# EAGLE design tsalivd (EAGLE 5.11)
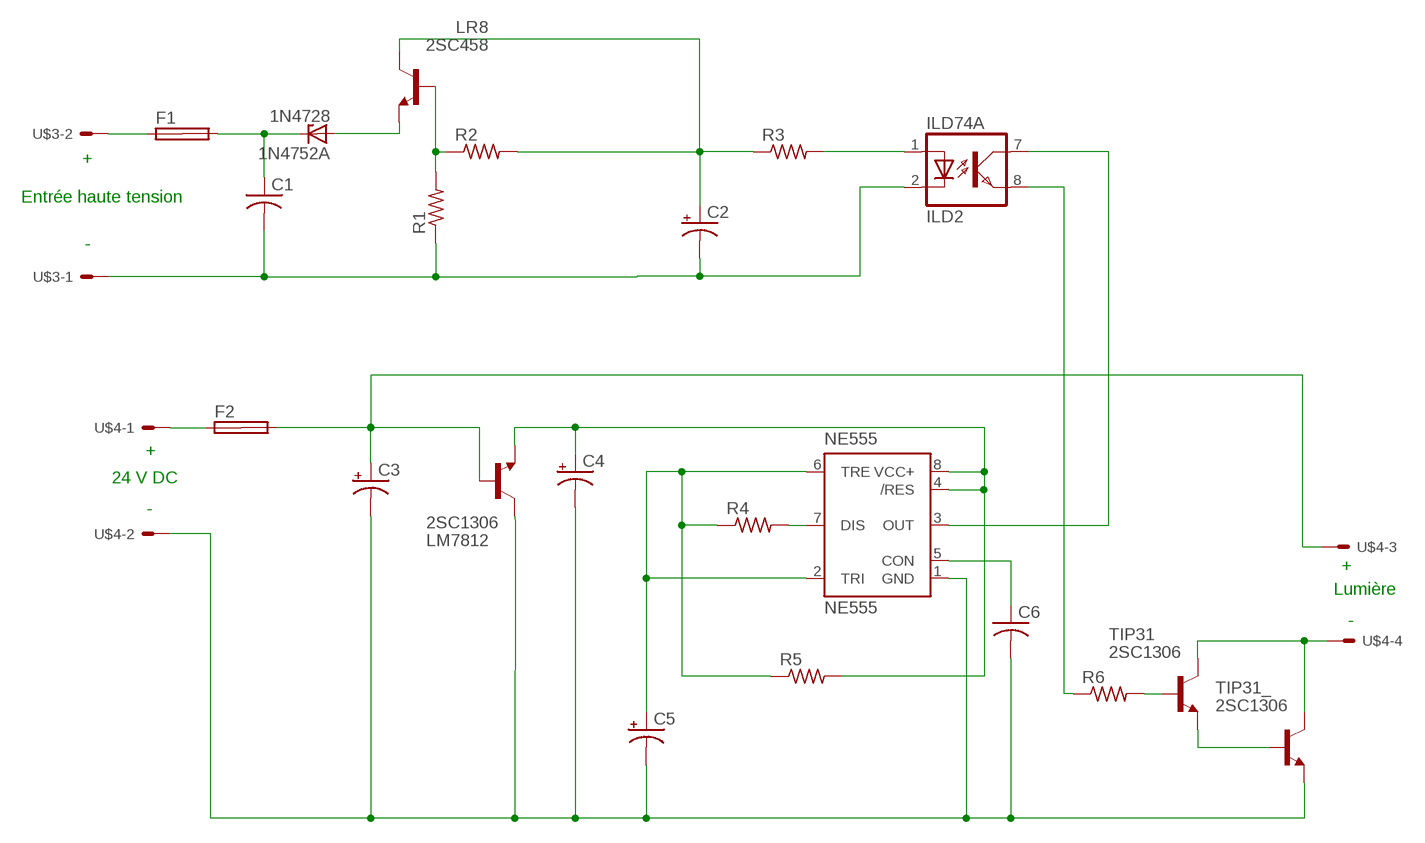
[diagram p0: schematic, sheet 1]

## Parts
1N4752A  1N4728  [DO41Z10]
C1  C-US275-113X316  [C275-113X316]
C2  CPOL-USE2-5  [E2-5]
C3  CPOL-USE2-5  [E2-5]
C4  CPOL-USE2-5  [E2-5]
C5  CPOL-USE2-5  [E2-5]
C6  C-US025-030X050  [C025-030X050]
F1  SHKOG  [SHKOG]
F2  SHKOG  [SHKOG]
ILD74  ILD2  [DIL08]
LM7812  2SC1306  [TO220BV]
LR8  2SC458  [TO92-ECB]
NE555  NE555  [DIL-08]
R1  R-US_0207/10  [0207/10]
R2  R-US_0207/10  [0207/10]
R3  R-US_0207/10  [0207/10]
R4  R-US_0207/10  [0207/10]
R5  R-US_0207/10  [0207/10]
R6  R-US_0207/10  [0207/10]
TIP31  2SC1306  [TO220BV]
TIP31_  2SC1306  [TO220BV]
U$3  10-84-4020  [10-84-4020]
U$4  10-84-4040  [10-84-4040]

## Nets
GND_HV: C1.2 C2.- ILD74.2(A:C) R1.1 U$3.1
GND_LV: C3.- C4.- C5.- C6.2 LM7812.2(C) NE555.1(GND) TIP31_.3(E) U$4.2
N$1: F1.1A U$3.2
N$2: F2.1A U$4.1
N$3: 1N4752A.A LR8.E
N$4: LR8.B R1.2 R2.1
N$5: ILD74.1(A:A) R3.2
N$8: C2.+ R2.2 R3.1
N$9: ILD74.7(A:COL) NE555.3(OUT)
N$10: C6.1 NE555.5(CON)
N$11: TIP31.3(E) TIP31_.1(B)
N$12: NE555.7(DIS) R4.2
N$13: TIP31.2(C) TIP31_.2(C) U$4.4
N$14: C3.+ F2.2A LM7812.1(B) U$4.3
N$15: 1N4752A.C C1.1 F1.2A
N$16: C4.+ LM7812.3(E) NE555.4(/RES) NE555.8(VCC+) R5.2
N$17: C5.+ NE555.2(TRI) NE555.6(TRE) R4.1 R5.1
N$19: R6.2 TIP31.1(B)
N$20: ILD74.8(A:EMIT) R6.1
Unconnected: F1.1B F1.2B F2.1B F2.2B ILD74.3(B:C) ILD74.4(B:A) ILD74.5(B:EMIT) ILD74.6(B:COL) LR8.C

## Notes on the sheet
- +
- Entrée haute tension
- -
- +
- 24 V DC
- -
- +
- Lumière
- -

## Library data of the parts
1N4752A = diode:1N4728: Z DIODE 3.3 V, 1W, 5 percent
C1 C6 = resistor:C-US: CAPACITOR, American symbol
C2-C5 = resistor:CPOL-US: POLARIZED CAPACITOR, American symbol
F1 F2 = fuse:SHKOG: FUSE HOLDER 5 x 20/6 x 32 mm, SH contact, OG 46G6083 Buerklin; OC_FARNELL: unknown; OC_NEWARK: unknown
ILD74 = optocoupler:ILD2: SIEMENS OPTO COUPLER; OC_FARNELL: 1469596; OC_NEWARK: unknown
LM7812 TIP31 TIP31_ = transistor:2SC1306: NPN Transistor Final RF Power Outupt Source: 2sc1306.pdf
LR8 = transistor:2SC458: NPN Silicon Epitaxial Planar Transistor Source: SEMTECH ELECTRONICS LTD. ... 2SC458 1.pdf
NE555 = st-microelectronics:NE555: General purpose bipolar Timer; MF: Arrow Electronics; MPN: NE555N; OC_FARNELL: 1467742; OC_NEWARK: 89K1486
R1-R6 = resistor:R-US_: RESISTOR, American symbol
U$3 = connecteur_molex:10-84-4020
U$4 = connecteur_molex:10-84-4040

## Board
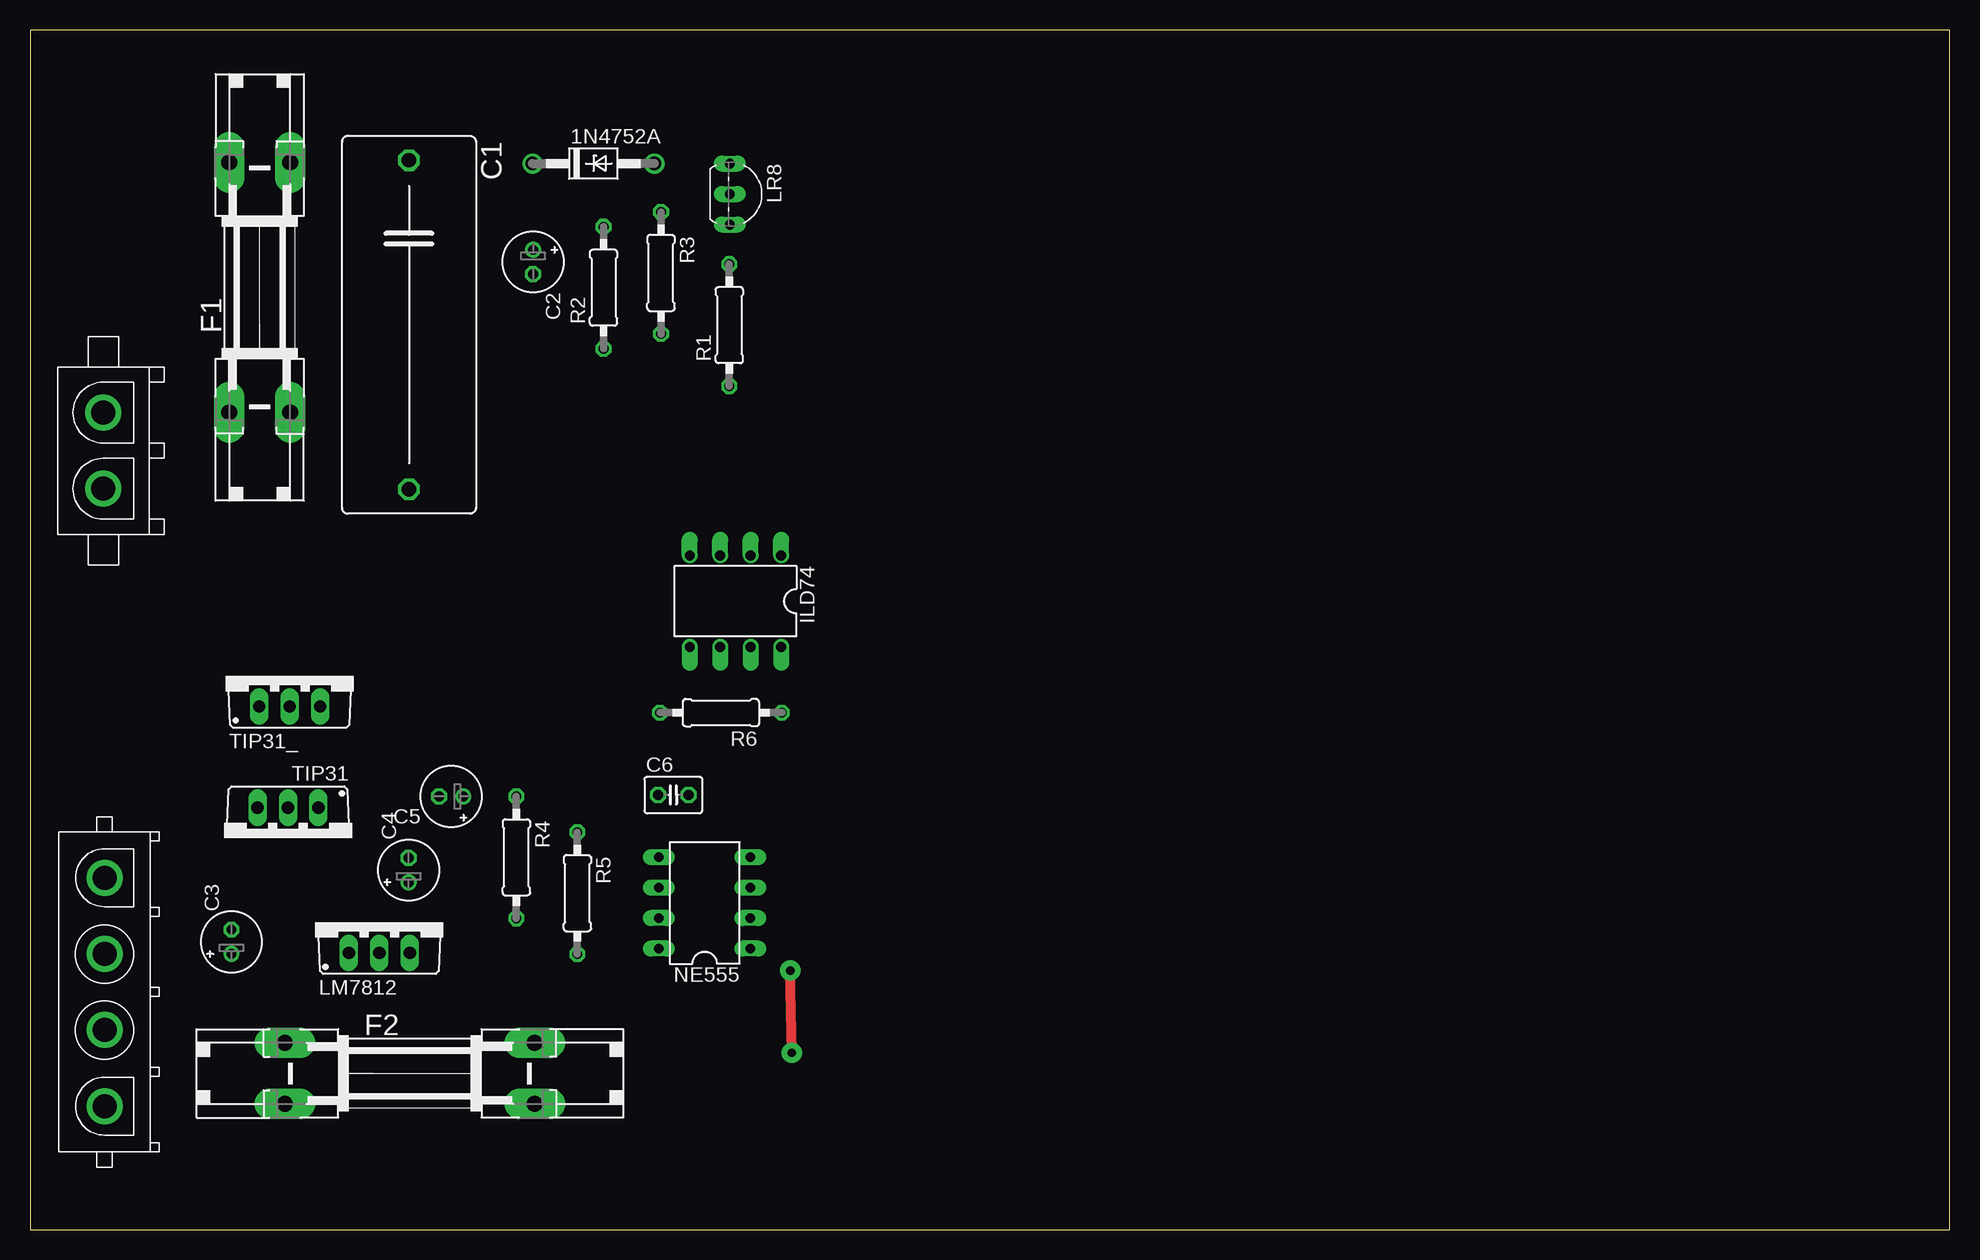
[diagram p1: board, top side]
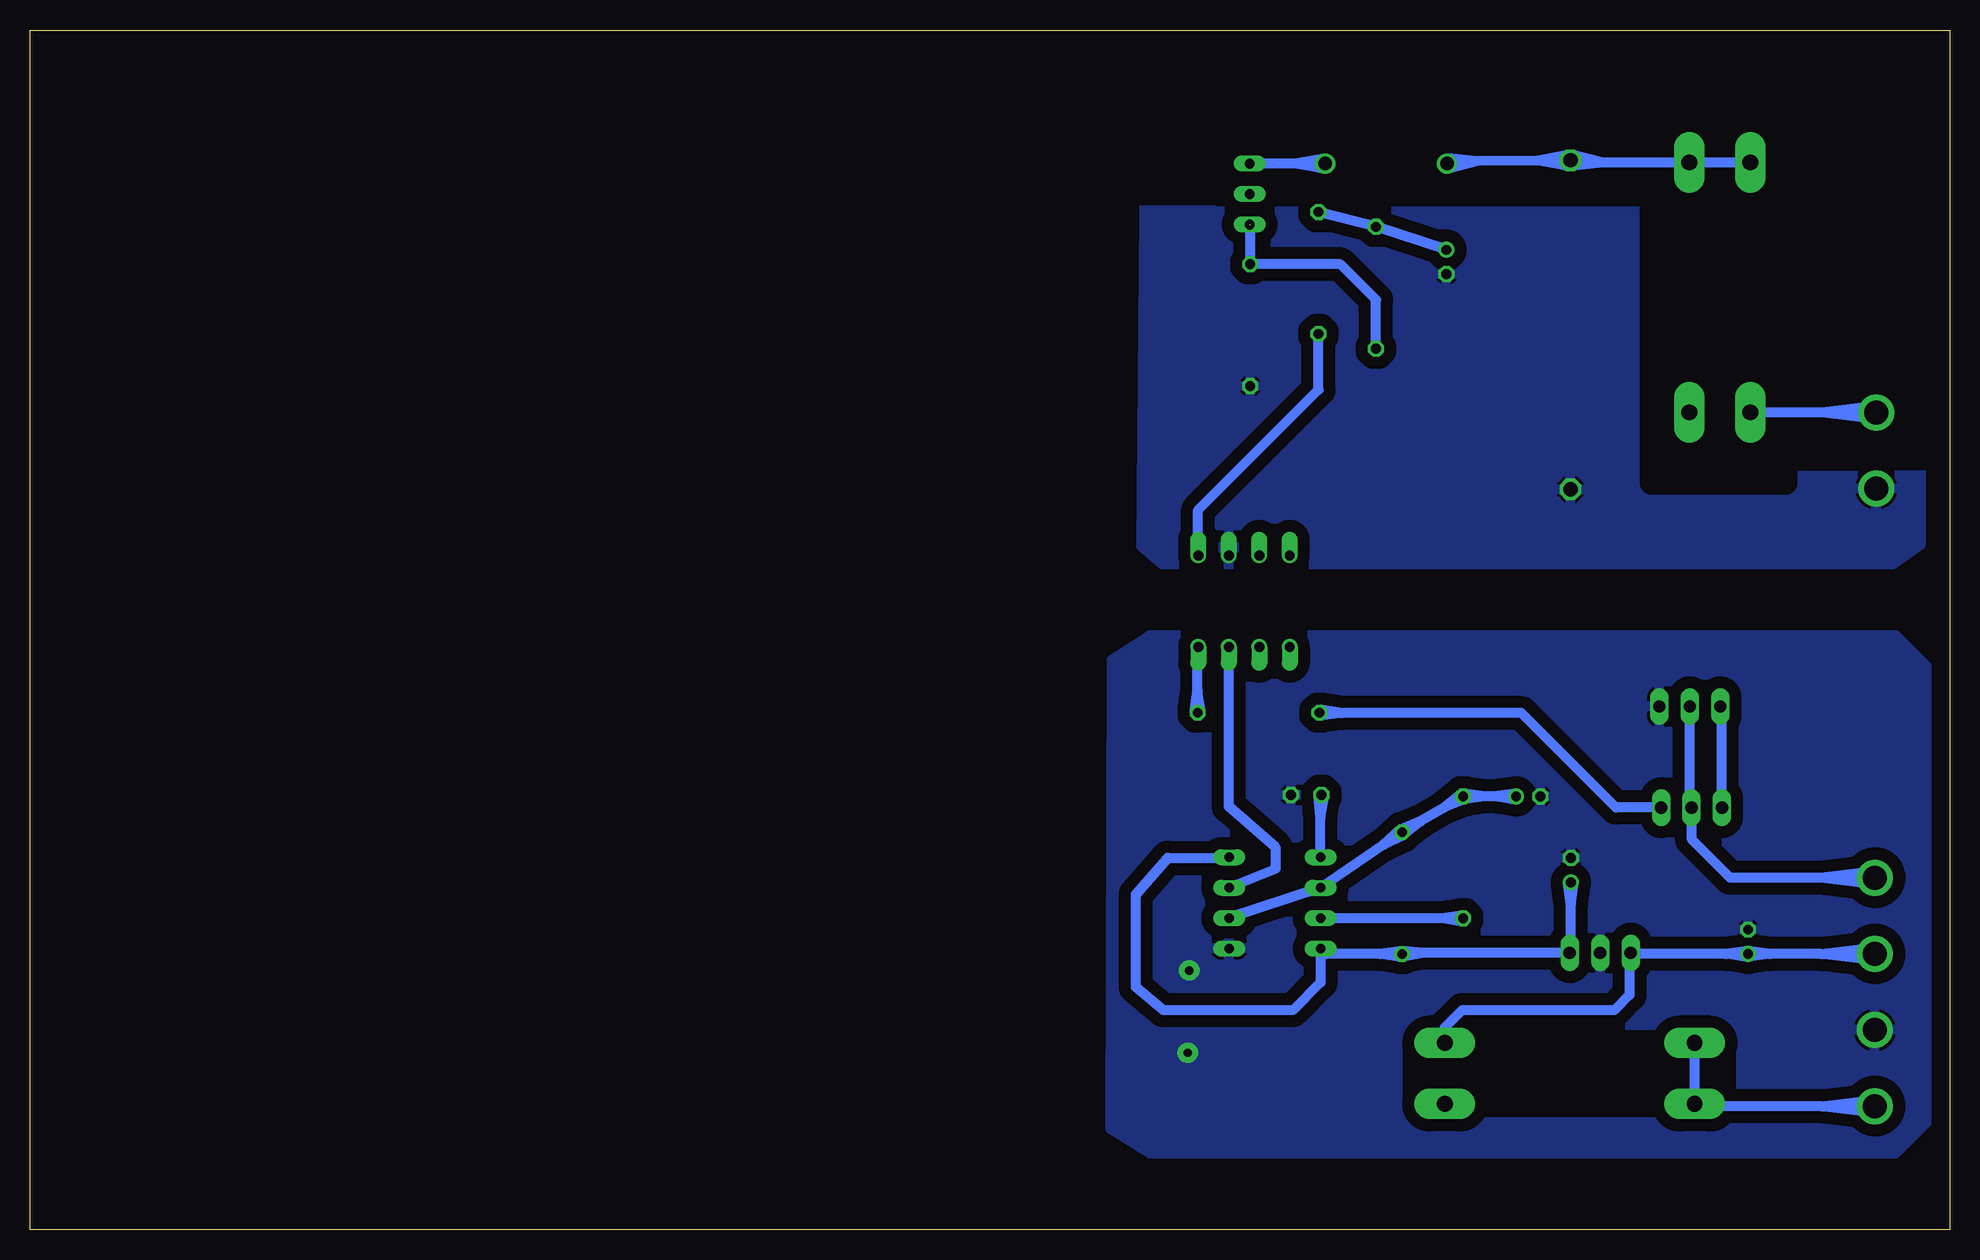
[diagram p2: board, bottom side, seen from below]

Size 160 x 100 mm. Coordinates in mm from the lower left corner, seen from the top.
Outline: 0,0 160,0 160,100 0,100 0,0
Copper layers (1*16): Top 0.035mm / dielectric 1.5mm / Bottom 0.035mm
Design rules "default": minimum track width 10mil, minimum drill 24mil, track to track 8mil, track to pad 8mil, pad to pad 8mil, via to via 8mil, smd to smd 8mil, copper to edge 40mil, drill to drill 8mil, minimum pad ring 10mil, minimum via ring 8mil, stop-mask expansion 4mil, vias tented up to drill 0mil, thermal gap 10mil
bRestrict: area 23.9,10.4 to 39.4,15.6; area 13.7,71.5 to 18.9,86.8; area 43.4,10.5 to 44.6,15.6; area 18.8,10.5 to 19.9,15.6; area 16.6,65.5 to 21.7,66.7; area 32.5,86.3 to 51.3,91.6; area 1.5,68.2 to 20.3,73.5; area 42,86.3 to 60.8,91.6; area 13.7,86.3 to 32.5,91.6; area 6,68.3 to 24.8,73.6; area 6,64.3 to 24.8,69.6; area 1.6,64.3 to 6.7,65.4; 7 more areas

### Footprints (pad centres in the part's own frame; a part is rotated, then mirrored left to right if it is on the bottom)
DO41Z10 = drill 1.118 round: A 5.08,0; C -5.08,0
C275-113X316 = drill 1.194 octagon: 1 -13.716,0; 2 13.716,0
E2-5 = drill 0.813 pad 1.27 round: + -1.016,0 | drill 0.813 pad 1.27 octagon: - 1.016,0
C025-030X050 = drill 0.813 octagon: 1 -1.27,0; 2 1.27,0
SHKOG = drill 1.321 pad 2.54 long: 1A -10.414,2.54; 1B -10.414,-2.54; 2A 10.414,2.54; 2B 10.414,-2.54
DIL08 = drill 0.813 offset: 1 -3.81,-3.81; 2 -1.27,-3.81; 3 1.27,-3.81; 4 3.81,-3.81; 5 3.81,3.81; 6 1.27,3.81; 7 -1.27,3.81; 8 -3.81,3.81
TO220BV = drill 1.016 long: 1 -2.54,-2.54; 2 0,-2.54; 3 2.54,-2.54
TO92-ECB = drill 0.813 long: B 2.54,0; C 0,0; E -2.54,0
DIL-08 = drill 0.813 long: 1 -3.81,-3.81; 2 -1.27,-3.81; 3 1.27,-3.81; 4 3.81,-3.81; 5 3.81,3.81; 6 1.27,3.81; 7 -1.27,3.81; 8 -3.81,3.81
0207/10 = drill 0.813 octagon: 1 -5.08,0; 2 5.08,0
10-84-4020 = drill 2 round: 1 -3.175,0; 2 3.175,0
10-84-4040 = drill 2 round: 1 -9.525,0; 2 -3.175,0; 3 3.175,0; 4 9.525,0

### Placement (x,y rotation side)
1N4752A  46.96,88.87 0 top
C1  31.59,75.42 270 top
C2  41.93,80.66 270 top
C3  16.8,23.99 90 top
C4  31.56,29.96 90 top
C5  35.11,36.11 180 top
C6  53.62,36.23 0 top
F1  19.15,78.54 90 top
F2  31.66,13.01 0 top
ILD74  58.8,52.38 180 top
LM7812  29.12,25.61 0 top
LR8  58.34,86.31 270 top
NE555  56.23,27.23 90 top
R1  58.29,75.39 90 top
R2  47.81,78.51 90 top
R3  52.6,79.74 270 top
R4  40.54,31.03 270 top
R5  45.62,28.04 270 top
R6  57.59,43.08 180 top
TIP31  21.5,32.63 180 top
TIP31_  21.66,46.14 0 top
U$3  6.12,64.93 90 top
U$4  6.21,19.8 90 top

### Tracks (layer width: path | path; a pad name or v marks a point on that pad's centre or on a via)
GND_HV
  pour Bottom (isolate 1.016): 2.31,93.98 2.41,57.05 4.7,55.45 65.61,55.45 67.36,56.95 67.01,93.85 65.41,95.45 3.78,95.45
GND_LV  (via drill 0.7 pad 1.68)
  Top 0.813: v63.5,14.73 v63.37,21.59
  pour Bottom (isolate 1.016): 4.45,49.53 66.67,49.53 69.85,47.5 69.98,8.38 66.67,6.35 4.45,6.35 1.91,8.89 1.91,46.99
N$1
  Bottom 0.813: U$3.2 9.62,68.11 | 9.62,68.11 10.62,68.11 | 10.62,68.11 16.59,68.11 F1.1A | 9.62,68.11 6.21,68.64 U$3.2 | 9.62,68.11 6.21,67.56 U$3.2 | 10.62,68.11 6.19,68.65 U$3.2 | 10.62,68.11 6.19,67.56 U$3.2
N$2
  Bottom 0.813: U$4.1 9.71,10.28 | 10.71,10.28 9.71,10.28 | 10.71,10.28 21.25,10.28 F2.1A | 9.71,10.28 6.3,10.82 U$4.1 | 9.71,10.28 6.3,9.74 U$4.1 | 10.71,10.28 6.28,10.82 U$4.1 | 10.71,10.28 6.28,9.73 U$4.1
N$3
  Bottom 0.813: 1N4752A.A 54,88.87 | 54,88.87 54.56,88.87 | 54.56,88.87 58.33,88.87 LR8.E | 54,88.87 52.14,89.29 1N4752A.A | 54,88.87 52.14,88.44 1N4752A.A | 54.56,88.87 52.12,89.29 1N4752A.A | 54.56,88.87 52.12,88.44 1N4752A.A
N$4  (1 unrouted)
  Bottom 0.813: R2.1 47.81,77.5 50.77,80.47 R1.2 58.29,83.73
N$5
  Bottom 0.813: R3.2 52.6,70.01 62.64,59.97 62.64,56.22 ILD74.1
N$8
  Bottom 0.813: C2.+ R2.2 R3.1
N$9
  Bottom 0.813: ILD74.7 60.07,35.25 56.16,31.85 56.16,30.07 NE555.3
N$10
  Bottom 0.813: C6.1 52.42,36.23 52.42,34.81 | NE555.5 52.42,34.4 | 52.42,34.4 52.42,34.81 | 52.42,34.81 52.61,36.19 C6.1 | 52.42,34.81 52.11,36.17 C6.1 | 52.42,34.4 52.61,36.2 C6.1 | 52.42,34.4 52.1,36.18 C6.1
N$11
  Bottom 0.813: TIP31.3 18.96,43.45 TIP31_.1
N$12
  Bottom 0.813: R4.2 41.96,25.95 | 41.96,25.95 42.37,25.95 | 42.37,25.95 52.41,25.95 NE555.7 | 41.96,25.95 40.59,26.2 R4.2 | 41.96,25.95 40.59,25.7 R4.2 | 42.37,25.95 40.58,26.2 R4.2 | 42.37,25.95 40.58,25.7 R4.2
N$13
  Bottom 0.813: U$4.4 9.71,29.33 | 9.71,29.33 10.71,29.33 | 10.71,29.33 18.28,29.33 21.46,32.51 21.46,35.13 TIP31.2 21.66,35.32 TIP31_.2 | 9.71,29.33 6.3,29.87 U$4.4 | 9.71,29.33 6.3,28.79 U$4.4 | 10.71,29.33 6.28,29.87 U$4.4 | 10.71,29.33 6.28,28.79 U$4.4
N$14
  Bottom 0.813: U$4.3 9.71,22.98 | 10.71,22.98 9.71,22.98 | 10.71,22.98 14.97,22.98 | 14.97,22.98 15.37,22.98 | 15.37,22.98 16.92,22.98 C3.+ | C3.+ 18.22,22.97 | 18.22,22.97 18.62,22.97 | 18.62,22.97 26.48,22.97 LM7812.1 26.67,22.98 26.67,19.56 27.94,18.29 40.64,18.29 42.08,16.85 F2.2A | 15.37,22.98 16.75,22.72 C3.+ | 15.37,22.98 16.75,23.22 C3.+ | 18.22,22.97 16.84,23.22 C3.+ | 18.22,22.97 16.84,22.72 C3.+ | 9.71,22.98 6.3,23.52 U$4.3 | 9.71,22.98 6.3,22.44 U$4.3 | 14.97,22.98 16.76,22.72 C3.+ | 14.97,22.98 16.76,23.22 C3.+ | 18.62,22.97 16.83,23.22 C3.+ | 18.62,22.97 16.83,22.72 C3.+ | 10.71,22.98 6.28,23.52 U$4.3 | 10.71,22.98 6.28,22.43 U$4.3
N$15
  Bottom 0.813: F1.2A 28.91,88.96 | 28.91,88.96 29.51,88.96 | 29.51,88.96 30.72,88.96 C1.1 | C1.1 33.68,89.12 | 33.68,89.12 39.38,89.08 | 39.38,89.08 41.69,89.06 1N4752A.C | 1N4752A.C 41.74,88.46 39.94,89.08 41.83,89.3 1N4752A.C | 29.51,88.96 31.52,88.66 C1.1 | 29.51,88.96 31.43,89.6 C1.1 | 33.68,89.12 31.71,89.61 C1.1 | 33.68,89.12 31.7,88.66 C1.1 | 39.38,89.08 41.77,88.45 1N4752A.C | 39.38,89.08 41.84,89.3 1N4752A.C | 28.91,88.96 31.53,88.65 C1.1 | 28.91,88.96 31.47,89.61 C1.1 | C1.1 31.68,89.62 34.27,89.12 31.67,88.66 C1.1
N$16
  Bottom 0.813: R5.2 47.05,22.96 | 47.05,22.96 47.45,22.96 | 47.45,22.96 51.96,22.96 NE555.8 52.42,20.6 54.74,18.29 65.53,18.29 67.82,20.19 67.82,27.94 65.15,30.99 60.1,30.99 NE555.4 | 31.56,27.12 31.56,23.18 LM7812.3 43.8,23.07 | 31.56,27.12 31.56,27.52 | 31.56,27.52 C4.+ | 43.8,23.07 44.21,23.07 | 44.21,23.07 45.51,23.07 R5.2 | 31.56,27.52 31.81,28.9 C4.+ | 31.56,27.52 31.31,28.9 C4.+ | 47.05,22.96 45.67,23.21 R5.2 | 47.05,22.96 45.67,22.71 R5.2 | 44.21,23.07 45.56,22.71 R5.2 | 44.21,23.07 45.6,23.21 R5.2 | 31.56,27.12 31.81,28.91 C4.+ | 31.56,27.12 31.31,28.91 C4.+ | 47.45,22.96 45.66,23.21 R5.2 | 47.45,22.96 45.66,22.71 R5.2 | 43.8,23.07 45.57,22.71 R5.2 | 43.8,23.07 45.6,23.21 R5.2
N$17
  Bottom 0.813: C5.+ 37.55,36.11 | 37.55,36.11 37.96,36.11 | 37.96,36.11 38.71,36.11 | 38.71,36.11 39.12,36.11 | 39.12,36.11 R4.1 | R4.1 41.77,35.39 | 41.77,35.39 42.12,35.18 | 42.12,35.18 44.05,34.05 | 44.05,34.05 44.4,33.84 | 44.4,33.84 R5.1 | R5.1 47.14,32.09 | 47.14,32.09 NE555.6 NE555.2 | 37.55,36.11 36.18,36.36 C5.+ | 37.55,36.11 36.18,35.86 C5.+ | 44.4,33.84 45.46,32.93 R5.1 | 44.4,33.84 45.71,33.36 R5.1 | R5.1 45.8,33.3 46.8,32.32 45.52,32.89 R5.1 | 39.12,36.11 40.49,35.86 R4.1 | 39.12,36.11 40.49,36.36 R4.1 | 41.77,35.39 40.7,36.3 R4.1 | 41.77,35.39 40.45,35.87 R4.1 | 37.96,36.11 36.17,36.36 C5.+ | 37.96,36.11 36.17,35.85 C5.+ | 44.05,34.05 45.47,32.92 R5.1 | 44.05,34.05 45.72,33.35 R5.1 | 47.14,32.09 45.8,33.31 R5.1 | 47.14,32.09 45.51,32.89 R5.1 | 38.71,36.11 40.5,35.85 R4.1 | 38.71,36.11 40.5,36.36 R4.1 | 42.12,35.18 40.7,36.3 R4.1 | 42.12,35.18 40.44,35.87 R4.1
N$19
  Bottom 0.813: R6.2 52.47,43.04 | TIP31.1 27.8,35.17 35.69,43.05 50.68,43.05 | 50.68,43.05 51.09,43.05 | 51.09,43.05 52.48,43.05 R6.2 | 51.09,43.05 52.47,42.83 R6.2 | 51.09,43.05 52.46,43.33 R6.2 | 50.68,43.05 52.48,42.83 R6.2 | 50.68,43.05 52.47,43.34 R6.2
N$20
  Bottom 0.813: R6.1 62.67,44.51 | 62.67,44.51 62.67,44.91 | 62.67,44.91 62.67,48.51 ILD74.8 | 62.67,44.51 62.42,43.13 R6.1 | 62.67,44.51 62.92,43.13 R6.1 | 62.67,44.91 62.42,43.12 R6.1 | 62.67,44.91 62.92,43.12 R6.1